# Altium schematic sheet Periféricos.SchDoc
size A4
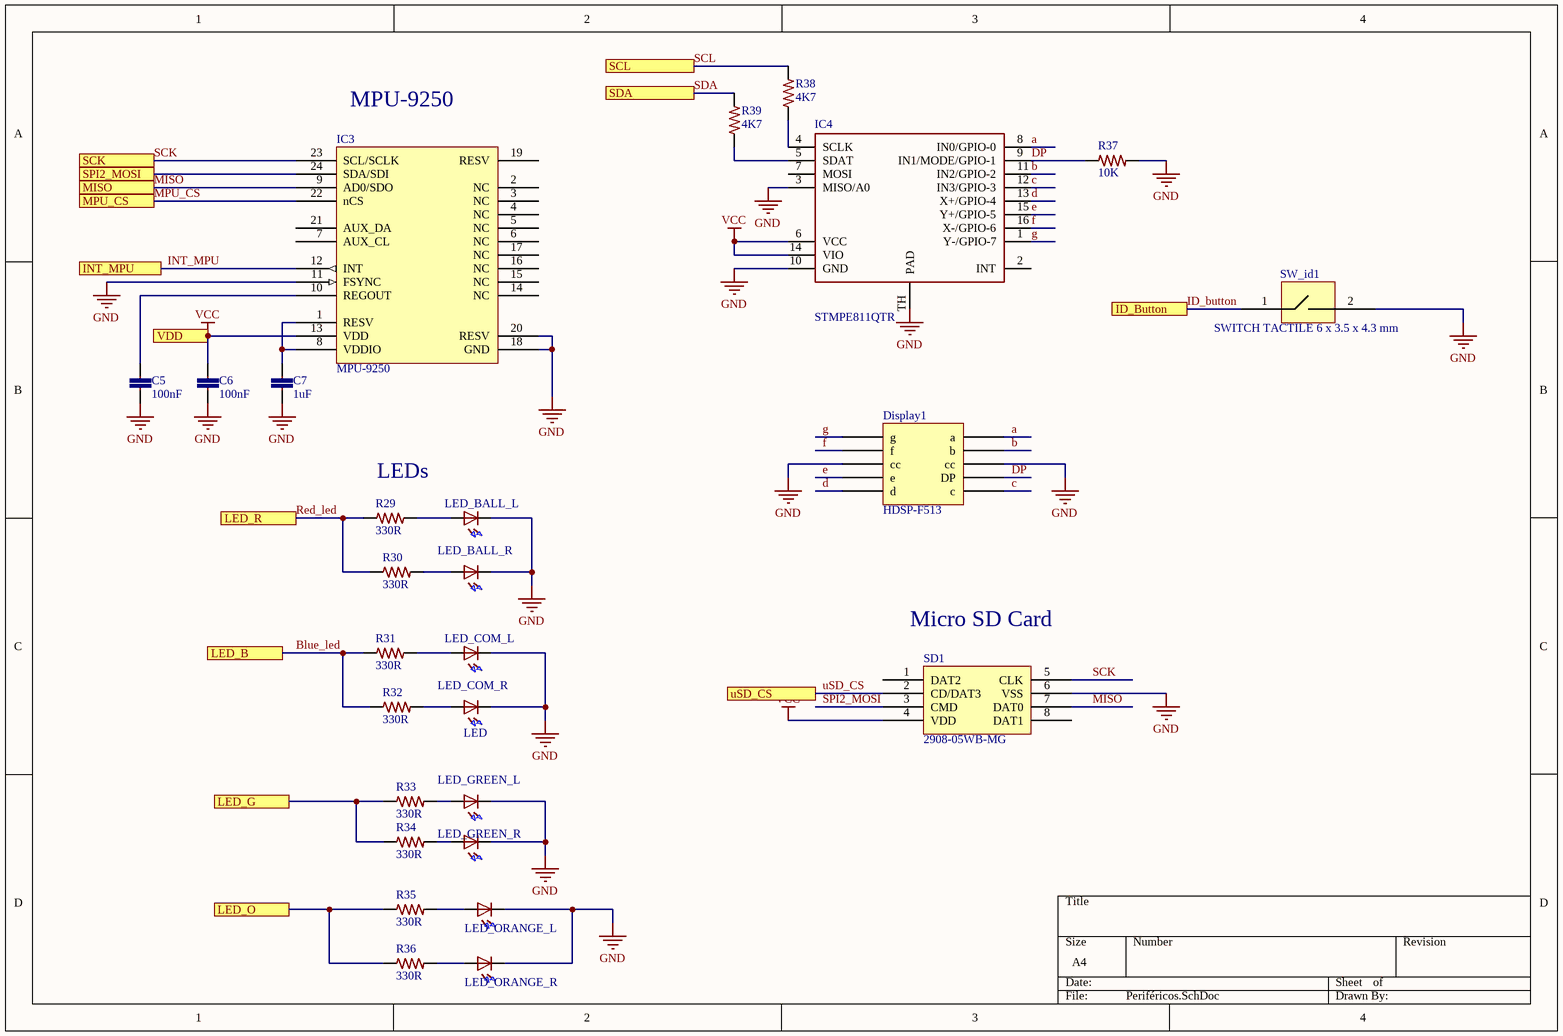
[diagram p0: Periféricos.SchDoc]

## Parts
C5  100nF  [0402-CAP]
C6  100nF  [0402-CAP]
C7  1uF  [0402-CAP]
Display1  HDSP-F513  [New footprint 1]
IC3  MPU-9250  [MPU-9250]
IC4  STMPE811QTR  [QFN16_N]
LED_BALL_L  LED  [LED-5MM-PCB]  (value not drawn)
LED_BALL_R  LED  [LED-5MM-PCB]  (value not drawn)
LED_COM_L  LED  [LED-5MM-PCB]  (value not drawn)
LED_COM_R  LED  [LED-5MM-PCB]
LED_GREEN_L  LED  [LED-5MM-PCB]  (value not drawn)
LED_GREEN_R  LED  [LED-5MM-PCB]  (value not drawn)
LED_ORANGE_L  LED  [LED-5MM-PCB]  (value not drawn)
LED_ORANGE_R  LED  [LED-5MM-PCB]  (value not drawn)
R29  330R  [0402-RES-HD]
R30  330R  [0402-RES-HD]
R31  330R  [0402-RES-HD]
R32  330R  [0402-RES-HD]
R33  330R  [0402-RES-HD]
R34  330R  [0402-RES-HD]
R35  330R  [0402-RES-HD]
R36  330R  [0402-RES-HD]
R37  10K  [0402-RES-HD]
R38  4K7  [0402-RES-HD]
R39  4K7  [0402-RES-HD]
SD1  2908-05WB-MG  [New footprint 1]
SW_id1  SWITCH TACTILE 6 x 3.5 x 4.3 mm  [PCBComponent]

## Ports
ID_Button, INT_MPU, LED_B, LED_G, LED_O, LED_R, MISO, MPU_CS, SCK, SCL, SDA, SPI2_MOSI, uSD_CS, VDD

## Nets
GND: C5.2 C6.2 C7.2 Display1.3(cc) Display1.8(cc) IC3.11(FSYNC) IC3.18(GND) IC3.20(RESV) IC4.3(MISO/A0) IC4.10(GND) IC4.TH(PAD) LED_BALL_L.1(K) LED_BALL_R.1(K) LED_COM_L.1(K) LED_COM_R.1(K) LED_GREEN_L.1(K) LED_GREEN_R.1(K) LED_ORANGE_L.1(K) LED_ORANGE_R.1(K) R37.2 SD1.6(VSS) SW_id1.2
VCC: C6.1 IC3.13(VDD) IC4.6(VCC) IC4.14(VIO) SD1.4(VDD) ; port VDD
a: Display1.6(a) IC4.8(IN0/GPIO-0)
b: Display1.7(b) IC4.11(IN2/GPIO-2)
Blue_led: R31.1 R32.1 ; port LED_B
c: Display1.10(c) IC4.12(IN3/GPIO-3)
d: Display1.5(d) IC4.13(X+/GPIO-4)
DP: Display1.9(DP) IC4.9(IN1/MODE/GPIO-1) R37.1
e: Display1.4(e) IC4.15(Y+/GPIO-5)
f: Display1.2(f) IC4.16(X-/GPIO-6)
g: Display1.1(g) IC4.1(Y-/GPIO-7)
ID_button: SW_id1.1 ; port ID_Button
INT_MPU: IC3.12(INT) ; port INT_MPU
LED_G: R33.1 R34.1 ; port LED_G
LED_O: R35.1 R36.1 ; port LED_O
MISO: IC3.9(AD0/SDO) SD1.7(DAT0) ; port MISO
MPU_CS: IC3.22(nCS) ; port MPU_CS
Red_led: R29.1 R30.1 ; port LED_R
SCK: IC3.23(SCL/SCLK) SD1.5(CLK) ; port SCK
SCL: R38.2 ; port SCL
SDA: R39.2 ; port SDA
SPI2_MOSI: IC3.24(SDA/SDI) ; port SPI2_MOSI
SPI2_MOSI: SD1.3(CMD)  [a separate net that carries the same name]
uSD_CS: SD1.2(CD/DAT3) ; port uSD_CS
NetC5_1: C5.1 IC3.10(REGOUT)
NetC7_1: C7.1 IC3.1(RESV) IC3.8(VDDIO)
NetIC4_4: IC4.4(SCLK) R38.1
NetIC4_5: IC4.5(SDAT) R39.1
NetLED_BALL_L_2: LED_BALL_L.2(A) R29.2
NetLED_BALL_R_2: LED_BALL_R.2(A) R30.2
NetLED_COM_L_2: LED_COM_L.2(A) R31.2
NetLED_COM_R_2: LED_COM_R.2(A) R32.2
NetLED_GREEN_L_2: LED_GREEN_L.2(A) R33.2
NetLED_GREEN_R_2: LED_GREEN_R.2(A) R34.2
NetLED_ORANGE_L_2: LED_ORANGE_L.2(A) R35.2
NetLED_ORANGE_R_2: LED_ORANGE_R.2(A) R36.2

Not connected (* = marked no-connect by the designer): IC3 2(NC) 3(NC) 4(NC) 5(NC) 6(NC) 7(AUX_CL) 14(NC) 15(NC) 16(NC) 17(NC) 19(RESV) 21(AUX_DA); IC4 2(INT) 7(MOSI); SD1 1(DAT2) 8(DAT1)

## Notes on the sheet
- (near IC3) MPU-9250
- (near R29) LEDs
- (near SD1) Micro SD Card

## Library data of the parts
C5 C6 = CC0402-100nF-A.12: CAP CER 0.1UF 10V 20% X5R 0402; Part No: VJ0402V104ZXQPBC; Cod EMS: 05.281.006.133; Value: 100n
C7 = CC0402-1uF-5: CAP CER 1UF 6.3V 10% X5R 0402; Part No: JMK105BJ105KV-F; Cod EMS: 05.281.019.513; Value: 1u
Display1 = HDSP-F513-01.A.1: 7 segments display
IC3 = MPU-9250-1: IMU ACCEL/GYRO/MAG I2C/SPI 24QFN; Part No: MPU-9250
IC4 = STMPE811QTR-6: IC TSC I/O EXPAND 8B 16QFN; Cod EMS: 05.284.001.511; Part No: STMPE811QTR
LED_BALL_L LED_BALL_R LED_COM_L LED_COM_R LED_GREEN_L LED_GREEN_R LED_ORANGE_L LED_ORANGE_R = LED-5MM-3: LED 5MM PTH
R29-R36 = R0402-330R-7: RES 330 OHM 1/10W 1% 0402 SMD; Part No: ERJ-2RKF3300X; Cod EMS: 05.280.029.506; Value: 330; Family Description: RESISTOR FILME ESPESSO 10R-1M / 1/10W / 1% / 0402. P/N: ERJ-2RKF....X – PANASONIC ELECTRONIC COMPONENTS.; Family: ERJ-2RKF....X
R37 = R0402-10K-11: RES 10K OHM 1/10W 1% 0402 SMD; Part No: ERJ-2RKF1002X; Cod EMS: 05.280.029.525; Family Description: RESISTOR FILME ESPESSO 10R-1M / 1/10W / 1% / 0402. P/N: ERJ-2RKF....X – PANASONIC ELECTRONIC COMPONENTS.; Value: 10K; Family: ERJ-2RKF....X
R38 R39 = R0402-4K7-6: RES 4.7K OHM 1/10W 1% 0402 SMD; Part No: ERJ-2RKF4701X; Cod EMS: 05.280.029.526; Family Description: RESISTOR FILME ESPESSO 10R-1M / 1/10W / 1% / 0402. P/N: ERJ-2RKF....X – PANASONIC ELECTRONIC COMPONENTS.; Value: 4.7K; Family: ERJ-2RKF....X
SD1 = 2908-05WB-MG-01.A.1: CONN MICRO SD CARD PUSH-PUSH R/A
SW_id1 = 95C04A3GWRT.-1: GRAYHILL TACT,GW,6X3.5,1800T&R,LF Eight, 160g Operating Force, Gull Wing, RoHS Compliant; Part No: 95C04A3GWRT